# EAGLE schematic Board 3 Teensy (EAGLE 9.3.2)
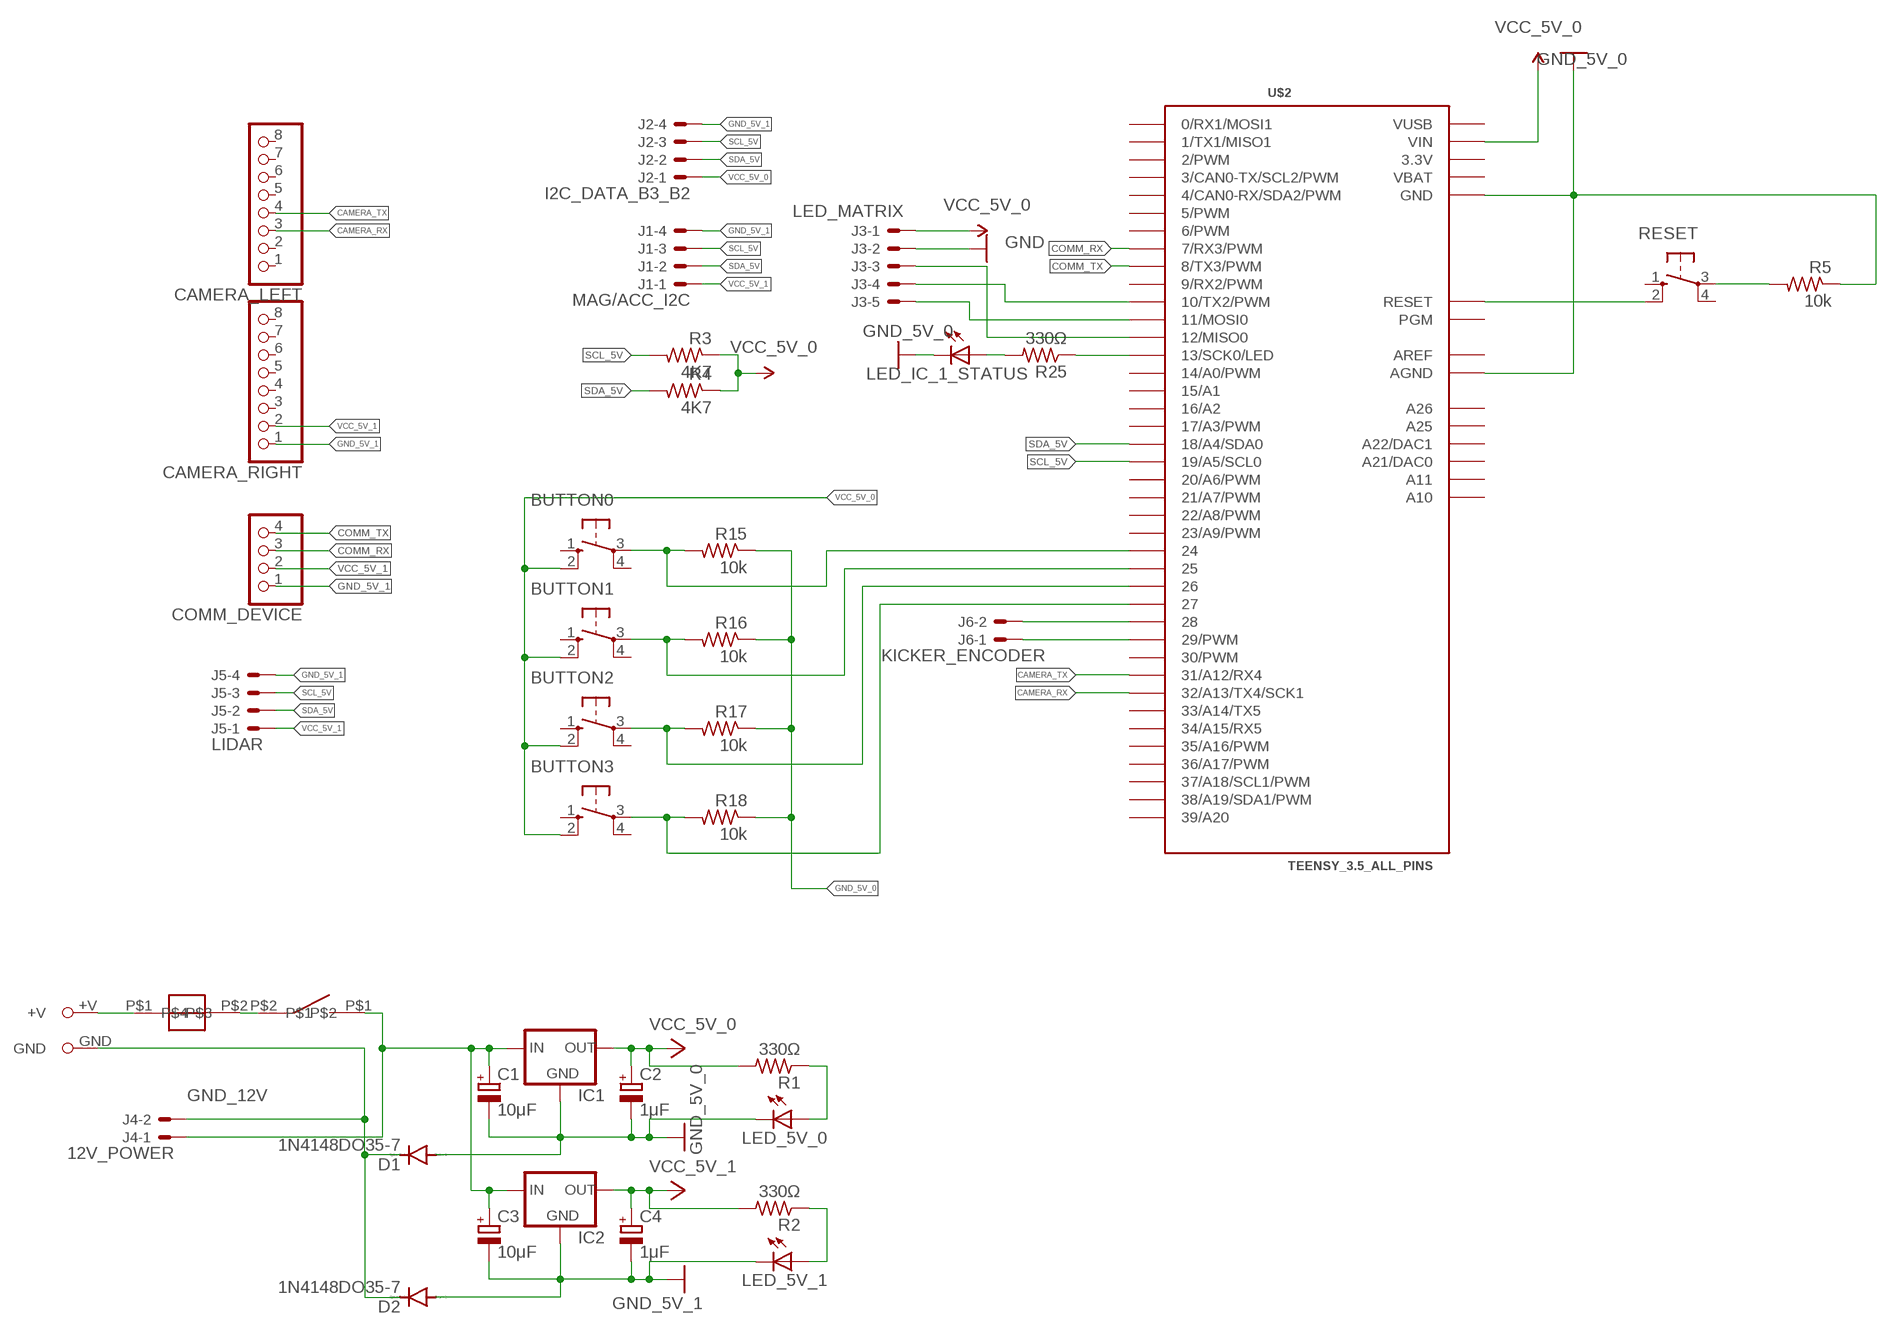
[diagram p0: schematic, sheet 1]

## Parts
BUTTON0  10-XX  [B3F-10XX]
BUTTON1  10-XX  [B3F-10XX]
BUTTON2  10-XX  [B3F-10XX]
BUTTON3  10-XX  [B3F-10XX]
C1  10μF  CPOL-EUE2-5  [E2-5]
C2  1μF  CPOL-EUE2-5  [E2-5]
C3  10μF  CPOL-EUE2-5  [E2-5]
C4  1μF  CPOL-EUE2-5  [E2-5]
CAMERA_LEFT  PINHD-1X8  [1X08]
CAMERA_RIGHT  PINHD-1X8  [1X08]
COMM_DEVICE  PINHD-1X4  [1X04]
D1  1N4148DO35-7  [DO35-7]
D2  1N4148DO35-7  [DO35-7]
IC1  78XXS  [78XXS]
IC2  78XXS  [78XXS]
J1  MAG/ACC_I2C  22-27-2041-04  [6410-04]
J2  I2C_DATA_B3_B2  22-27-2041-04  [6410-04]
J3  LED_MATRIX  22-27-2051-05  [6410-05]
J4  12V_POWER  22-27-2021-02  [6410-02]
J5  LIDAR  22-27-2041-04  [6410-04]
J6  KICKER_ENCODER  22-27-2021-02  [6410-02]
LED_5V_0  LEDP-LCC-2  [P-LCC-2]
LED_5V_1  LEDP-LCC-2  [P-LCC-2]
LED_IC_1_STATUS  LEDP-LCC-2  [P-LCC-2]
R1  330Ω  R-US_0207/10  [0207/10]
R2  330Ω  R-US_0207/10  [0207/10]
R3  4K7  R-US_0207/9  [0207/9]
R4  4K7  R-US_0207/9  [0207/9]
R5  10k  R-US_0207/9  [0207/9]
R15  10k  R-US_0207/9  [0207/9]
R16  10k  R-US_0207/9  [0207/9]
R17  10k  R-US_0207/9  [0207/9]
R18  10k  R-US_0207/9  [0207/9]
R25  330Ω  R-US_0207/10  [0207/10]
RESET  10-XX  [B3F-10XX]
SICHERUNG1  SICHERUNG  [SICHERUNG]
U$1  XT60  [XT60]
U$2  TEENSY_3.5_ALL_PINS  [TEENSY_3.5_ALL_PINS]
U$17  SCHALTER  [SCHALTER]

## Nets
+12V [+12V Power]: C1.+ C3.+ IC1.IN IC2.IN J4.1 U$17.P$1
BUTTON_0: BUTTON0.3(P) R15.2 U$2.24
CAMERA_RX: CAMERA_LEFT.3 U$2.32/A13(32/A13/TX4/SCK1)
CAMERA_TX: CAMERA_LEFT.4 U$2.31/A12(31/A12/RX4)
COMM_RX: COMM_DEVICE.3 U$2.7(7/RX3/PWM)
COMM_TX: COMM_DEVICE.4 U$2.8(8/TX3/PWM)
GND [+12V Power]: J3.2
GND_5V_0 [+12V Power]: C1.- C2.- D1.A IC1.GND LED_5V_0.C LED_IC_1_STATUS.C R5.1 R15.1 R16.1 R17.1 R18.1 U$2.AGND U$2.GND U$2.GND1(GND) U$2.GND3(GND) U$2.GND4(GND) U$2.GND6(GND)
GND_5V_1 [+12V Power]: C3.- C4.- CAMERA_RIGHT.1 COMM_DEVICE.1 D2.A IC2.GND J1.4 J2.4 J5.4 LED_5V_1.C
GND_12V [+12V Power]: D1.C D2.C J4.2 U$1.GND
N$1 [+12V Power]: SICHERUNG1.P$1 U$1.+V
N$2 [+12V Power]: SICHERUNG1.P$2 U$17.P$2
N$3: R25.1 U$2.13(13/SCK0/LED)
N$4: J3.3 U$2.12(12/MISO0)
N$5: J3.4 U$2.10(10/TX2/PWM)
N$6: J3.5 U$2.11(11/MOSI0)
N$7: BUTTON1.3(P) R16.2 U$2.25
N$8: BUTTON2.3(P) R17.2 U$2.26
N$9 [+5V Power]: LED_5V_1.A R2.1
N$10 [+5V Power]: LED_5V_0.A R1.1
N$11: BUTTON3.3(P) R18.2 U$2.27
N$12: J6.2 U$2.28
N$13: J6.1 U$2.29(29/PWM)
N$18: RESET.2(S1) U$2.RESET
N$19: R5.2 RESET.3(P)
N$25: LED_IC_1_STATUS.A R25.2
SCL_5V: J1.3 J2.3 J5.3 R3.2 U$2.19/A5(19/A5/SCL0)
SDA_5V: J1.2 J2.2 J5.2 R4.2 U$2.18/A4(18/A4/SDA0)
VCC_5V_0 [+5V Power]: BUTTON0.2(S1) BUTTON1.2(S1) BUTTON2.2(S1) BUTTON3.2(S1) C2.+ IC1.OUT J2.1 J3.1 R1.2 R3.1 R4.1 U$2.VIN
VCC_5V_1 [+5V Power]: C4.+ CAMERA_RIGHT.2 COMM_DEVICE.2 IC2.OUT J1.1 J5.1 R2.2
Unconnected: BUTTON0.1(S) BUTTON0.4(P1) BUTTON1.1(S) BUTTON1.4(P1) BUTTON2.1(S) BUTTON2.4(P1) BUTTON3.1(S) BUTTON3.4(P1) CAMERA_LEFT.1 CAMERA_LEFT.2 CAMERA_LEFT.5 CAMERA_LEFT.6 CAMERA_LEFT.7 CAMERA_LEFT.8 CAMERA_RIGHT.3 CAMERA_RIGHT.4 CAMERA_RIGHT.5 CAMERA_RIGHT.6 CAMERA_RIGHT.7 CAMERA_RIGHT.8 RESET.1(S) RESET.4(P1) U$2.0(0/RX1/MOSI1) U$2.1(1/TX1/MISO1) U$2.2(2/PWM) U$2.3(3/CAN0-TX/SCL2/PWM) U$2.4(4/CAN0-RX/SDA2/PWM) U$2.5(5/PWM) U$2.6(6/PWM) U$2.9(9/RX2/PWM) U$2.14/A0(14/A0/PWM) U$2.15/A1 U$2.16/A2 U$2.17/A3(17/A3/PWM) U$2.20/A6(20/A6/PWM) U$2.21/A7(21/A7/PWM) U$2.22/A8(22/A8/PWM) U$2.23/A9(23/A9/PWM) U$2.30(30/PWM) U$2.33/A14(33/A14/TX5) U$2.34/A15(34/A15/RX5) U$2.35/A16(35/A16/PWM) U$2.36/A17(36/A17/PWM) U$2.37/A18(37/A18/SCL1/PWM) U$2.38/A19(38/A19/SDA1/PWM) U$2.39/A20 U$2.A10 U$2.A11 U$2.A21(A21/DAC0) U$2.A22(A22/DAC1) U$2.A25 U$2.A26 U$2.PGM

## Power pins joined to a net without a drawn wire
3.3V: U$2.3.3V U$2.3.3V3(3.3V) U$2.3.3V4(3.3V)
AREF: U$2.AREF
VBAT: U$2.VBAT
VUSB: U$2.VUSB

## Library data of the parts
BUTTON0 BUTTON1-BUTTON3 RESET = switch-omron:10-XX: OMRON SWITCH; MF: OMRON ELECTRONIC COMPONENTS; MPN: B3F-1000; OC_FARNELL: 176432; OC_NEWARK: 36M3542
C1-C4 = rcl:CPOL-EU: POLARIZED CAPACITOR, European symbol; SPICEPREFIX: C
CAMERA_LEFT CAMERA_RIGHT = pinhead:PINHD-1X8: PIN HEADER
COMM_DEVICE = pinhead:PINHD-1X4: PIN HEADER
D1 D2 = diode:1N4148: DIODE high speed (Philips)
IC1 IC2 = v-reg:78XXS: VOLTAGE REGULATOR
J1 J2 J5 = con-molex:22-?-04: CONNECTOR wire to board 2.54 mm (.1 inch) pitch header; MF: MOLEX; OC_FARNELL: unknown; OC_NEWARK: unknown
J3 = con-molex:22-?-05: CONNECTOR wire to board 2.54 mm (.1 inch) pitch header; MF: MOLEX; OC_FARNELL: unknown; OC_NEWARK: unknown
J4 J6 = con-molex:22-?-02: CONNECTOR wire to board 2.54 mm (.1 inch) pitch header; MF: MOLEX; OC_FARNELL: unknown; OC_NEWARK: unknown
LED_5V_0 LED_5V_1 LED_IC_1_STATUS = adafruit:LED: LED OSRAM: - CHIPLED LG R971, LG N971, LY N971, LG Q971, LY Q971, LO R971, LY R971 LH N974, LH R974 LS Q976, LO Q976, LY Q976 LO Q996 - Hyper CHIPLED LW Q18S LB Q993, LB Q99A, LB R99A - SideLED LS A670, LO A670, LY A670, LG A670, LP A670 LB A673, LV A673, LT A673, LW A673 LH A674 LY A675 LS A676, LA A676, LO A676, LY A676, LW A676 LS A679, LY A679, LG A679 - Hyper Micro SIDELED® LS Y876, LA Y876, LO Y876, LY Y876 LT Y87S - SmartLED LW L88C, LW L88S LB L89C, LB L89S, LG L890 LS L89K, LO L89K, LY L89K LS L896, LA L896, LO L896, LY L896 - TOPLED LS T670, LO T670, LY T670, LG T670, LP T670 LSG T670, LSP T670, LSY T670, LOP T670, LYG T670 LG T671, LOG T671, LSG T671 LB T673, LV T673, LT T673, LW T673 LH T674 LS T676, LA T676, LO T676, LY T676, LB T676, LH T676, LSB T676, LW T676 LB T67C, LV T67C, LT T67C, LS T67K, LO T67K, LY T67K, LW E67C LS E67B, LA E67B, LO E67B, LY E67B, LB E67C, LV E67C, LT E67C LW T67C LS T679, LY T679, LG T679 LS T770, LO T770, LY T770, LG T770, LP T770 LB T773, LV T773, LT T773, LW T773 LH T774 LS E675, LA E675, LY E675, LS T675 LS T776, LA T776, LO T776, LY T776, LB T776 LHGB T686 LT T68C, LB T68C - Hyper Mini TOPLED® LB M676 - Mini TOPLED Santana® LG M470 LS M47K, LO M47K, LY M47K Source: http://www.osram.convergy.de/
R1 R2 R25 = resistor:R-US_: RESISTOR, American symbol
R3-R5 R15-R18 = adafruit:R-US_: RESISTOR, American symbol
SICHERUNG1 = sicherung1:SICHERUNG
U$1 = Connectors:XT60
U$2 = Teensy_3_and_LC_Series_Boards_v1.4:TEENSY_3.5_ALL_PINS: All PIN version of the Teensy 3.5. Note: the NC pin is not shown in symbol package, not connected here either.
U$17 = Schalter:SCHALTER

## Net classes
0 default: width 0.305 mm, clearance 0.152 mm
1 +12V Power: width 2.032 mm, drill 1.397 mm, clearance 0.356 mm
2 +5V Power: width 0.508 mm, drill 0.61 mm, clearance 0.203 mm